# EAGLE design reDotSmart_0402_rev2 (EAGLE 7.2.0)
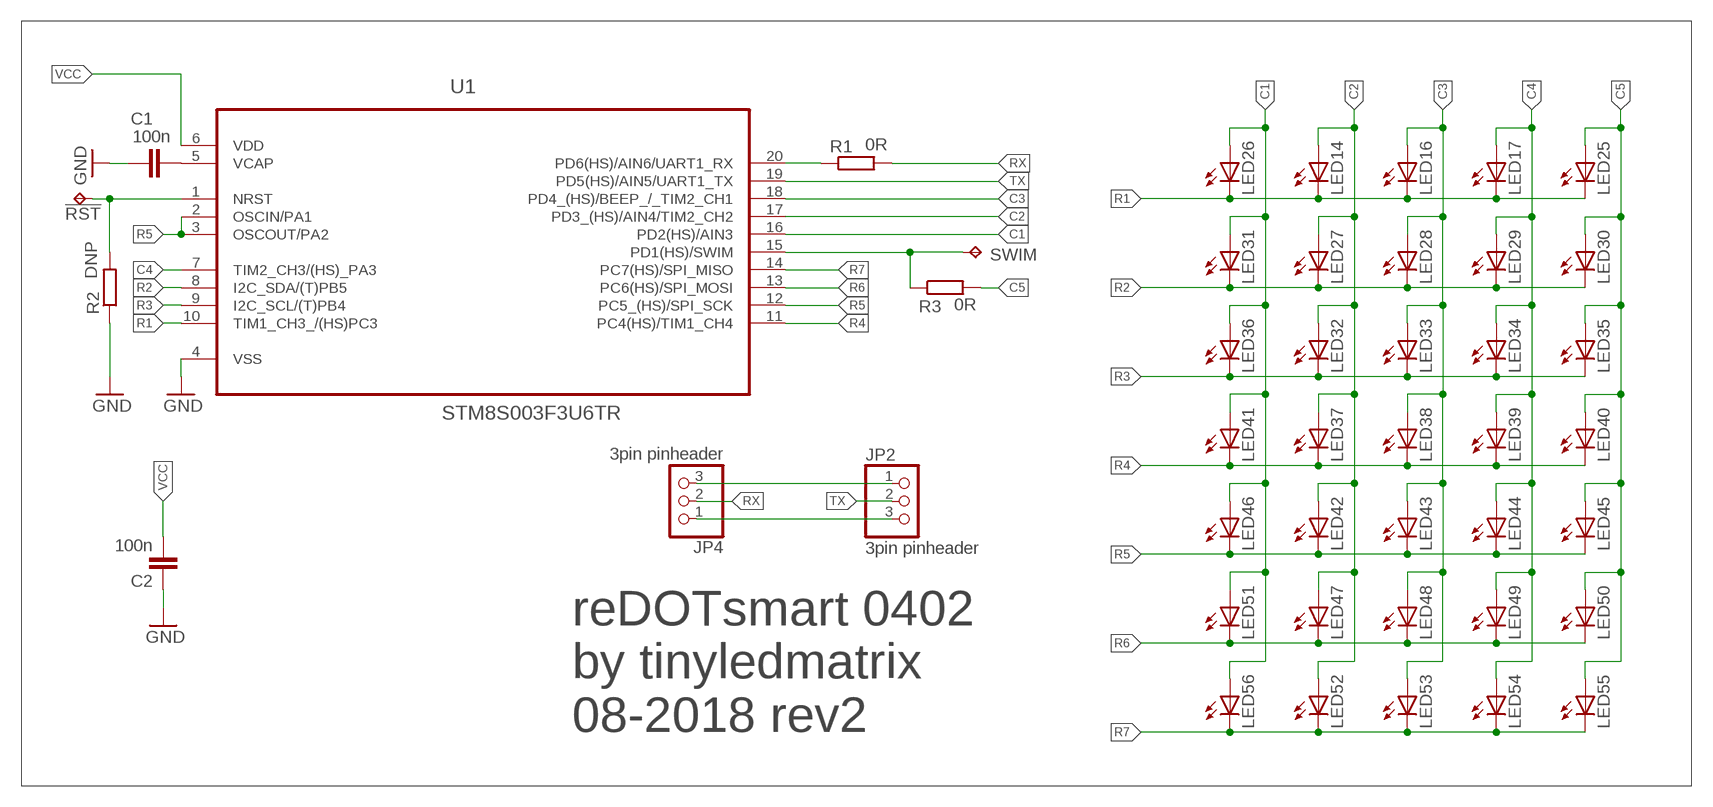
[diagram p0: schematic, sheet 1]

## Parts
!RST  TPTP10R  [TP10R]
C1  100n  C-EU0402_VISHAY  [C0402-VISHAY]
C2  100n  C-EU0402_VISHAY  [C0402-VISHAY]
JP2  3pin pinheader  PINHD-1X3NOSM  [1X03_ROUND_NOSM]
JP4  3pin pinheader  PINHD-1X3NOSM  [1X03_ROUND_NOSM]
LED14  LED0402_ROHM  [LED0402_E_ROHM_SML-P1]
LED16  LED0402_ROHM  [LED0402_E_ROHM_SML-P1]
LED17  LED0402_ROHM  [LED0402_E_ROHM_SML-P1]
LED25  LED0402_ROHM  [LED0402_E_ROHM_SML-P1]
LED26  LED0402_ROHM  [LED0402_E_ROHM_SML-P1]
LED27  LED0402_ROHM  [LED0402_E_ROHM_SML-P1]
LED28  LED0402_ROHM  [LED0402_E_ROHM_SML-P1]
LED29  LED0402_ROHM  [LED0402_E_ROHM_SML-P1]
LED30  LED0402_ROHM  [LED0402_E_ROHM_SML-P1]
LED31  LED0402_ROHM  [LED0402_E_ROHM_SML-P1]
LED32  LED0402_ROHM  [LED0402_E_ROHM_SML-P1]
LED33  LED0402_ROHM  [LED0402_E_ROHM_SML-P1]
LED34  LED0402_ROHM  [LED0402_E_ROHM_SML-P1]
LED35  LED0402_ROHM  [LED0402_E_ROHM_SML-P1]
LED36  LED0402_ROHM  [LED0402_E_ROHM_SML-P1]
LED37  LED0402_ROHM  [LED0402_E_ROHM_SML-P1]
LED38  LED0402_ROHM  [LED0402_E_ROHM_SML-P1]
LED39  LED0402_ROHM  [LED0402_E_ROHM_SML-P1]
LED40  LED0402_ROHM  [LED0402_E_ROHM_SML-P1]
LED41  LED0402_ROHM  [LED0402_E_ROHM_SML-P1]
LED42  LED0402_ROHM  [LED0402_E_ROHM_SML-P1]
LED43  LED0402_ROHM  [LED0402_E_ROHM_SML-P1]
LED44  LED0402_ROHM  [LED0402_E_ROHM_SML-P1]
LED45  LED0402_ROHM  [LED0402_E_ROHM_SML-P1]
LED46  LED0402_ROHM  [LED0402_E_ROHM_SML-P1]
LED47  LED0402_ROHM  [LED0402_E_ROHM_SML-P1]
LED48  LED0402_ROHM  [LED0402_E_ROHM_SML-P1]
LED49  LED0402_ROHM  [LED0402_E_ROHM_SML-P1]
LED50  LED0402_ROHM  [LED0402_E_ROHM_SML-P1]
LED51  LED0402_ROHM  [LED0402_E_ROHM_SML-P1]
LED52  LED0402_ROHM  [LED0402_E_ROHM_SML-P1]
LED53  LED0402_ROHM  [LED0402_E_ROHM_SML-P1]
LED54  LED0402_ROHM  [LED0402_E_ROHM_SML-P1]
LED55  LED0402_ROHM  [LED0402_E_ROHM_SML-P1]
LED56  LED0402_ROHM  [LED0402_E_ROHM_SML-P1]
R1  0R  R-EU_R0402-VISHAY  [ADAFRUIT_R0402-VISHAY]
R2  DNP  R-EU_R0402-VISHAY  [ADAFRUIT_R0402-VISHAY]
R3  0R  R-EU_R0603-VISHAY  [ADAFRUIT_R0603-VISHAY]
SWIM  TPTP10R  [TP10R]
U1  STM8S003F3U6TR  [QFN50P300X300X100-20N_STM]

## Nets
C1: LED26.A LED31.A LED36.A LED41.A LED46.A LED51.A LED56.A U1.16(PD2(HS)/AIN3)
C2: LED14.A LED27.A LED32.A LED37.A LED42.A LED47.A LED52.A U1.17(PD3_(HS)/AIN4/TIM2_CH2)
C3: LED16.A LED28.A LED33.A LED38.A LED43.A LED48.A LED53.A U1.18(PD4_(HS)/BEEP_/_TIM2_CH1)
C4: LED17.A LED29.A LED34.A LED39.A LED44.A LED49.A LED54.A U1.7(TIM2_CH3/(HS)_PA3)
C5: LED25.A LED30.A LED35.A LED40.A LED45.A LED50.A LED55.A R3.2
GND: C1.1 C2.1 JP2.1 JP4.3 R2.1 U1.4(VSS)
N$3: R1.1 U1.20(PD6(HS)/AIN6/UART1_RX)
N$4: R3.1 SWIM.TP U1.15(PD1(HS)/SWIM)
N$10: C1.2 U1.5(VCAP)
NRST: !RST.TP R2.2 U1.1(NRST)
R1: LED14.K(C) LED16.K(C) LED17.K(C) LED25.K(C) LED26.K(C) U1.10(TIM1_CH3_/(HS)PC3)
R2: LED27.K(C) LED28.K(C) LED29.K(C) LED30.K(C) LED31.K(C) U1.8(I2C_SDA/(T)PB5)
R3: LED32.K(C) LED33.K(C) LED34.K(C) LED35.K(C) LED36.K(C) U1.9(I2C_SCL/(T)PB4)
R4: LED37.K(C) LED38.K(C) LED39.K(C) LED40.K(C) LED41.K(C) U1.11(PC4(HS)/TIM1_CH4)
R5: LED42.K(C) LED43.K(C) LED44.K(C) LED45.K(C) LED46.K(C) U1.2(OSCIN/PA1) U1.3(OSCOUT/PA2) U1.12(PC5_(HS)/SPI_SCK)
R6: LED47.K(C) LED48.K(C) LED49.K(C) LED50.K(C) LED51.K(C) U1.13(PC6(HS)/SPI_MOSI)
R7: LED52.K(C) LED53.K(C) LED54.K(C) LED55.K(C) LED56.K(C) U1.14(PC7(HS)/SPI_MISO)
RX: JP4.2 R1.2
TX: JP2.2 U1.19(PD5(HS)/AIN5/UART1_TX)
VCC: C2.2 JP2.3 JP4.1 U1.6(VDD)

## Notes on the sheet
- reDOTsmart 0402
  by tinyledmatrix
  08-2018 rev2

## Library data of the parts
!RST SWIM = testpad:TP: Test pad
C1 C2 = rcl:C-EU: CAPACITOR, European symbol
JP2 JP4 = pinhead:PINHD-1X3: PIN HEADER
LED14 LED16 LED17 LED25-LED56 = led:LED: LED OSRAM: - CHIPLED LG R971, LG N971, LY N971, LG Q971, LY Q971, LO R971, LY R971 LH N974, LH R974 LS Q976, LO Q976, LY Q976 LO Q996 - Hyper CHIPLED LW Q18S LB Q993, LB Q99A, LB R99A - SideLED LS A670, LO A670, LY A670, LG A670, LP A670 LB A673, LV A673, LT A673, LW A673 LH A674 LY A675 LS A676, LA A676, LO A676, LY A676, LW A676 LS A679, LY A679, LG A679 - Hyper Micro SIDELED® LS Y876, LA Y876, LO Y876, LY Y876 LT Y87S - SmartLED LW L88C, LW L88S LB L89C, LB L89S, LG L890 LS L89K, LO L89K, LY L89K LS L896, LA L896, LO L896, LY L896 - TOPLED LS T670, LO T670, LY T670, LG T670, LP T670 LSG T670, LSP T670, LSY T670, LOP T670, LYG T670 LG T671, LOG T671, LSG T671 LB T673, LV T673, LT T673, LW T673 LH T674 LS T676, LA T676, LO T676, LY T676, LB T676, LH T676, LSB T676, LW T676 LB T67C, LV T67C, LT T67C, LS T67K, LO T67K, LY T67K, LW E67C LS E67B, LA E67B, LO E67B, LY E67B, LB E67C, LV E67C, LT E67C LW T67C LS T679, LY T679, LG T679 LS T770, LO T770, LY T770, LG T770, LP T770 LB T773, LV T773, LT T773, LW T773 LH T774 LS E675, LA E675, LY E675, LS T675 LS T776, LA T776, LO T776, LY T776, LB T776 LHGB T686 LT T68C, LB T68C - Hyper Mini TOPLED® LB M676 - Mini TOPLED Santana® LG M470 LS M47K, LO M47K, LY M47K Source: http://www.osram.convergy.de LUXEON: - LUMILED® LXK2-PW12-R00, LXK2-PW12-S00, LXK2-PW14-U00, LXK2-PW14-V00 LXK2-PM12-R00, LXK2-PM12-S00, LXK2-PM14-U00 LXK2-PE12-Q00, LXK2-PE12-R00, LXK2-PE12-S00, LXK2-PE14-T00, LXK2-PE14-U00 LXK2-PB12-K00, LXK2-PB12-L00, LXK2-PB12-M00, LXK2-PB14-N00, LXK2-PB14-P00, LXK2-PB14-Q00 LXK2-PR12-L00, LXK2-PR12-M00, LXK2-PR14-Q00, LXK2-PR14-R00 LXK2-PD12-Q00, LXK2-PD12-R00, LXK2-PD12-S00 LXK2-PH12-R00, LXK2-PH12-S00 LXK2-PL12-P00, LXK2-PL12-Q00, LXK2-PL12-R00 Source: www.luxeon.com KINGBRIGHT: KA-3528ASYC Source: www.kingbright.com
R1-R3 = rcl:R-EU_: RESISTOR, European symbol
U1 = STM-STM8S003_L78LxxUTR:STM8S003F3U6TR: Value line, 16 MHz STM8S 8-bit MCU, 8 Kbytes Flash, 128 bytes data EEPROM, 10-bit ADC, 3 timers, UART, SPI, I²C,20UFQFPN; MPN: STM8S003F3U6TR; OC_FARNELL: 2070941; OC_NEWARK: 75T8339; PACKAGE: 20UFQFPN; SUPPLIER: STMicroelectronics

## Board
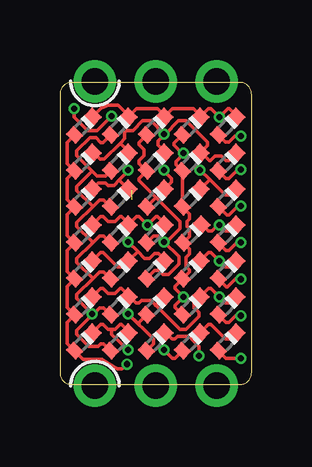
[diagram p1: board, top side]
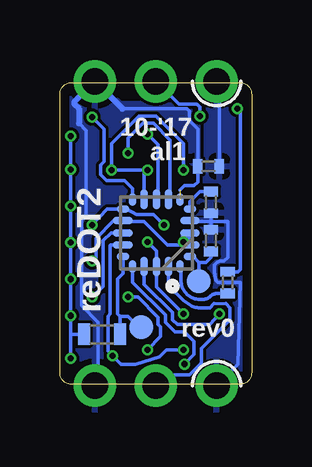
[diagram p2: board, bottom side, seen from below]

Size 8 x 12.6 mm. Coordinates in mm from the lower left corner, seen from the top.
Outline: 0,12.1 0,0.5 arc90 0.5,0 7.5,0 arc90 8,0.5 8,12.1 arc90 7.5,12.6 0.5,12.6 arc90 0,12.1
Copper layers (1*16): Top 0.035559375mm / dielectric 0.17018125mm / Bottom 0.035559375mm
Design rules "OSHPark-4layer *": minimum track width 5mil, minimum drill 10mil, track to track 5mil, track to pad 5mil, pad to pad 5mil, via to via 5mil, smd to smd 5mil, copper to edge 15mil, drill to drill 6mil, minimum pad ring 4mil, minimum via ring 4mil, stop-mask expansion 1mil, vias tented up to drill 10mil, thermal gap 10mil
bRestrict: 2 lines

### Footprints (pad centres in the part's own frame; a part is rotated, then mirrored left to right if it is on the bottom)
TP10R = smd 1 x 1: TP 0,0
C0402-VISHAY = smd 0.4 x 0.6: 1 -0.45,0; 2 0.45,0
1X03_ROUND_NOSM = drill 1.1 pad 1.778: 1 -2.54,0; 2 0,0; 3 2.54,0
LED0402_E_ROHM_SML-P1 = smd 0.5 x 0.6: A 0.55,0; K -0.55,0
ADAFRUIT_R0402-VISHAY = smd 0.4 x 0.6: 1 -0.45,0; 2 0.45,0
ADAFRUIT_R0603-VISHAY = smd 0.5 x 0.9: 1 -0.75,0; 2 0.75,0
QFN50P300X300X100-20N_STM = smd 0.508 x 0.305: 1 -1.397,0.991; 5 -1.397,-0.991; 11 1.397,-0.991; 15 1.397,0.991 | smd 0.813 x 0.305: 2 -1.397,0.508; 3 -1.397,0; 4 -1.397,-0.508; 12 1.397,-0.508; 13 1.397,0; 14 1.397,0.508 | smd 0.305 x 0.508: 6 -0.991,-1.397; 10 0.991,-1.397; 16 0.991,1.397; 20 -0.991,1.397 | smd 0.305 x 0.813: 7 -0.508,-1.397; 8 0,-1.397; 9 0.508,-1.397; 17 0.508,1.397; 18 0,1.397; 19 -0.508,1.397

### Placement (x,y rotation side)
!RST  2.2,4.3 0 bottom
C1  1.7,7.6 90 bottom
C2  1.8,9.1 180 bottom
JP2  4,-0.05 0 top
JP4  4,12.65 180 top
LED14  2.5,10.8 225 top
LED16  4,10.8 225 top
LED17  5.5,10.8 225 top
LED25  7,10.8 225 top
LED26  1,10.8 225 top
LED27  2.5,9.3 225 top
LED28  4,9.3 225 top
LED29  5.5,9.3 225 top
LED30  7,9.3 225 top
LED31  1,9.3 225 top
LED32  2.5,7.8 225 top
LED33  4,7.8 225 top
LED34  5.5,7.8 225 top
LED35  7,7.8 225 top
LED36  1,7.8 225 top
LED37  2.5,6.3 225 top
LED38  4,6.3 225 top
LED39  5.52,6.3 225 top
LED40  7,6.3 225 top
LED41  1,6.3 225 top
LED42  2.5,4.8 225 top
LED43  4,4.8 225 top
LED44  5.5,4.8 225 top
LED45  7,4.8 225 top
LED46  1,4.8 225 top
LED47  2.5,3.3 225 top
LED48  4,3.3 225 top
LED49  5.5,3.3 225 top
LED50  7,3.3 225 top
LED51  1,3.3 225 top
LED52  2.5,1.8 225 top
LED53  4,1.8 225 top
LED54  5.5,1.8 225 top
LED55  7,1.8 225 top
LED56  1,1.8 225 top
R1  1,4.25 90 bottom
R2  1.7,6 270 bottom
R3  6.25,2.1 180 bottom
SWIM  4.6,2.4 0 bottom
U1  3.97,6.33 180 bottom

### Tracks (layer width: path | path; a pad name or v marks a point on that pad's centre or on a via)
C1  (via drill 0.25)
  Top 0.127: 1.75,1.05 2.4,0.65
  Top 0.15: LED26.A 0.3,10.1 0.3,9.22 LED31.A 0.3,8.6 0.3,7.72 LED36.A 0.3,7.1 0.3,6.22 LED41.A 0.3,5.6 0.3,4.72 LED46.A 0.3,4.1 0.3,3.22 LED51.A 0.3,2.6 0.3,1.72 LED56.A 0.97,1.05 1.75,1.05 | 2.4,0.65 2.6,0.65 v2.8,0.85
  Bottom 0.15: v2.8,0.85 2.4,1.25 2.4,1.8 2.8,2.2 3.2,2.2 3.6,2.6 3.6,2.9 4.96,4.26 U1.16
C2  (via drill 0.25)
  Top 0.15: 1.38,4.42 0.7,5.1 0.7,5.25 1.34,5.89 | LED14.A 1.8,10.1 1.7,10.1 1.5,10.3 1.25,10.3 0.7,9.75 0.7,9.55 1.35,8.9 | LED52.A 1.82,1.7 1.7,1.7 1.6,1.6 1.2,1.6 0.7,2.1 0.7,2.25 1.35,2.9 v1.35,2.95 | LED42.A 1.82,4.7 1.65,4.7 1.38,4.42 | v1.35,2.95 0.7,3.6 0.7,3.75 1.38,4.42 | LED47.A 1.82,3.2 1.65,3.2 1.4,2.95 v1.35,2.95 | LED27.A 1.9,8.7 1.55,8.7 1.35,8.9 | 1.35,8.9 0.7,8.25 0.7,8.1 1.38,7.42 | LED32.A 1.82,7.7 1.65,7.7 1.38,7.42 | 1.38,7.42 0.7,6.75 0.7,6.6 1.34,5.96 1.34,5.89 | 1.34,5.89 1.65,6.2 1.82,6.2 LED37.A
  Bottom 0.15: U1.17 4.48,4.18 3.3,3 3.3,2.7 3.1,2.5 1.75,2.5 v1.35,2.95
C3  (via drill 0.25)
  Top 0.15: LED43.A 3.95,4.75 4.15,4.75 4.3,4.6 4.54,4.6 4.97,5.03 4.97,5.33 v4.35,5.95 | LED38.A 3.9,6.2 4.1,6.2 v4.35,5.95 | LED16.A | 4,7.8 3.3,8.5 3.3,8.6 LED28.A 3.3,9.22 3.3,9.35 3.5,9.55 3.5,9.8 3.3,10 3.3,10.1 LED16.A | 4,7.8 5,6.8 5,6.5 4.45,5.95 v4.35,5.95 | LED48.A 3.3,2.6 3.3,2.5 v2.85,2.95 3.9,1.9 3.9,1.7 LED53.A | LED33.A | LED33.A 4,7.8
  Bottom 0.15: v4.35,5.95 3.98,5.58 U1.18 3.98,4.07 v2.85,2.95
C4  (via drill 0.25)
  Top 0.15: LED17.A 4.76,10.06 4.76,9.98 5.09,9.65 v5.15,9.65 5.15,9.61 4.84,9.3 4.84,9.18 LED29.A LED34.A 5.4,7.12 5.4,6.9 5.3,6.8 5.3,6.6 5.4,6.5 5.4,6.18 LED39.A 5.4,5.65 5.4,5.45 5.25,5.3 5.25,4.92 5.4,4.78 5.4,4.7 LED44.A 4.8,4.1 4.8,4 v5.15,3.65 4.8,3.3 4.8,3.22 LED49.A | LED54.A 4.8,1.1 4.7,1.1 v4.35,1.45
  Bottom 0.15: U1.7 3.47,7.83 3.4,7.9 3.4,10.2 4.1,10.9 4.52,10.9 5.15,10.27 v5.15,9.65 | v5.15,3.65 4.75,3.65 3.9,2.8 3.9,2.5 3.8,2.4 3.8,2 v4.35,1.45
C5  (via drill 0.25)
  Top 0.15: LED25.A 6.91,10.11 7.05,10.11 7.3,10.36 v7.56,10.36 | LED30.A 6.94,8.59 7.05,8.59 7.43,8.97 v7.56,8.97 | LED35.A 6.96,7.06 7.05,7.06 7.43,7.44 v7.56,7.44 | LED40.A 6.93,5.59 7.05,5.59 7.38,5.92 v7.56,5.92 | LED45.A 6.96,4.06 7,4.06 7.33,4.39 v7.56,4.39 | v7.56,2.87 7.33,2.87 7.05,2.59 6.93,2.59 LED50.A | LED55.A 6.93,1.09 v7.56,1.09
  Bottom 0.15: v7.56,10.36 v7.56,8.97 v7.56,7.44 v7.56,5.92 v7.56,4.39 v7.56,2.87 7.56,2.1 | v7.56,1.09 7.56,2.1 | R3.2 7.56,2.1
GND
  Bottom 0.15: 1,0.41 JP2.1 | 0.58,0.83 0.48,4.25 1.4,4.25 1.48,4.33 1.48,4.35 1.55,4.67 1.55,4.99 1.44,5.1 1.32,5.15 1.15,5.15 1,5.3 1,6.8 1.7,6.8 | U1.4 2.54,6.8 1.7,6.8 | 1.7,6.8 R2.1 | 1.55,12.56 1.35,12.36 C2.1 | C1.1 1.7,6.8
  Bottom 0.152: 0.58,0.83 JP2.1
  pour Bottom (rank 2): 2.5,12.7 2.3,-1.1 -0.4,-1.1 -0.4,12.8
N$3
  Bottom 0.15: R1.1 1.44,3.8 arc-45 1.71,3.69 arc45 2.05,3.55 2.15,3.55 arc90 2.95,4.35 2.95,4.89 arc-90 U1.20
N$4
  Bottom 0.15: SWIM.TP 4.7,2.4 5.15,2.85 5.5,2.85 | 5.5,2.85 5.6,2.95 5.6,4.4 5.37,4.63 U1.15 | 5.5,2.85 R3.1
N$10
  Bottom 0.15: U1.5 2.58,7.62 2.15,8.05 C1.2
NRST
  Bottom 0.15: U1.1 2.44,5.33 2.2,5.1 | 2.2,5.1 !RST.TP | R2.2 1.7,5.3 1.9,5.1 2.2,5.1
R1  (via drill 0.25)
  Top 0.15: LED25.K 7.07,11.51 7,11.51 v6.65,11.16 6.3,11.51 6.21,11.51 LED17.K 5.57,11.51 5.56,11.5 4.71,11.5 4.71,11.51 LED16.K 4.07,11.51 3.21,11.51 LED14.K 2.43,11.65 2.03,11.65 1.72,11.52 LED26.K
  Bottom 0.15: U1.10 4.96,8.16 5.3,8.5 6.05,8.5 6.3,8.75 6.3,9.15 6.15,9.3 6.15,10.66 v6.65,11.16 6.4,10.91
R2  (via drill 0.25)
  Top 0.15: LED28.K 4.1,9.98 4.1,10.15 4.38,10.43 | LED30.K 7.05,9.35 6.92,9.35 6.74,9.53 6.46,9.53 6.29,9.35 6.23,9.35 LED29.K 6.16,9.96 6.16,10.11 5.27,11 4.95,11 4.38,10.43 | 2.52,10.07 2.7,10.25 2.7,10.5 2.8,10.6 3.05,10.6 3.45,11 3.8,11 v4.35,10.45 4.38,10.43 | LED27.K 2.52,10.05 2.52,10.07 | 2.52,10.07 1.85,9.4 1.68,9.4 LED31.K
  Bottom 0.15: U1.8 3.98,7.92 3.9,8 3.9,10 v4.35,10.45
R3  (via drill 0.25)
  Top 0.15: LED36.K 1.6,8.4 1.9,8.4 2,8.3 2.25,8.3 2.48,8.53 | LED32.K 2.81,8.19 2.48,8.53 | 2.48,8.53 2.85,8.9 v2.85,8.95 | LED35.K 7.1,7.9 6.9,7.9 6.25,8.55 | 6.25,8.55 v5.85,8.95 | LED34.K 6.25,8.55 | LED33.K 4.65,8.45 4.65,8.6 4.39,8.86 4.39,8.89 4.35,8.93 v4.35,8.95
  Bottom 0.15: v2.85,8.95 2.85,10.05 4,11.2 4.7,11.2 5.85,10.05 v5.85,8.95 v4.35,8.95 4.48,8.95 U1.9
R4  (via drill 0.25)
  Top 0.15: LED38.K 4.08,7 4,7 v3.65,6.65 3.3,7 3.2,7 LED37.K 2.58,7 2.5,7 2.3,6.8 2,6.8 1.8,7 1.7,7 LED41.K | LED40.K 7.1,6.4 6.9,6.4 v6.65,6.65 6.6,6.65 6.35,6.4 6.2,6.4 LED39.K
  Bottom 0.15: v6.65,6.65 6.03,7.32 U1.11 5.22,7.32 4.8,7.1 4.1,7.1 v3.65,6.65
R5  (via drill 0.25)
  Top 0.15: LED43.K 4.12,5.46 3.94,5.46 3.74,5.26 3.54,5.26 3.25,5.55 | LED44.K 6.2,5.5 6.3,5.5 v6.65,5.15 6.9,4.9 7.1,4.9 LED45.K | LED46.K 1.7,5.5 1.8,5.5 2.4,4.9 2.6,4.9 LED42.K 3.25,5.55 | 3.25,5.55 v2.85,5.95
  Bottom 0.15: 2.88,5.82 3.52,5.82 4.5,6.8 5.34,6.8 U1.12 5.77,6.83 6.5,6.1 6.5,5.3 v6.65,5.15 | 2.88,5.82 2.78,5.82 | 2.78,5.82 2.68,5.82 | 2.68,5.82 U1.2 U1.3 2.68,6.33 | v2.85,5.95 2.85,6.33 2.78,6.33 | 2.78,6.33 2.68,6.33 | 2.68,6.33 2.68,5.82 | 2.78,6.33 2.78,5.82 | 2.88,6.33 2.88,5.82
R6  (via drill 0.25)
  Top 0.15: LED51.K 1.7,4 1.8,4 2,3.8 2.3,3.8 2.5,4 2.58,4 LED47.K 3.18,3.4 3.3,3.4 3.4,3.5 3.8,3.5 4,3.3 | 4,3.3 LED48.K | LED50.K 7.1,3.4 | 7.1,3.4 | 7.1,3.4 6.9,3.4 v6.65,3.65 6.3,4 6.2,4 LED49.K 5.6,3.4 5.6,3.2 5.8,3 5.8,2.85 5.25,2.3 5,2.3 4,3.3 | 4,3.3
  Bottom 0.15: v6.65,3.65 6.2,4.1 6.2,6 5.88,6.33 U1.13
R7  (via drill 0.25)
  Top 0.15: LED53.K 4.68,1.9 4.8,1.9 4.9,2 5.4,2 5.55,1.85 | LED56.K 1.7,2.5 1.8,2.5 2,2.3 2.15,2.3 | 2.15,2.3 2.3,2.3 2.5,2.5 2.58,2.5 LED52.K | v2.85,1.45 2.15,2.1 2.15,2.3 | LED55.K 7.1,1.9 6.9,1.9 6.3,2.5 6.2,2.5 LED54.K 5.55,1.85 | 5.55,1.85 5.8,1.6 v5.8,1.2 | 5.55,1.85
  Bottom 0.15: v2.85,1.45 3.55,1.45 3.85,1.15 4.85,0.85 5.45,0.85 v5.8,1.2 6,1.4 6,2.85 5.9,2.95 5.9,5.8 5.88,5.82 U1.14
RX  (via drill 0.25)
  Top 0.15: v2.15,11.2 1.55,10.6 1.15,10.6 0.6,11.15 v0.6,11.5
  Bottom 0.15: 2.15,11.55 v2.15,11.2 2.15,11.56 2.28,11.69 3.04,11.69 JP4.2 | R1.2 0.58,4.7 0.48,4.8 0.48,11.38 v0.6,11.5
TX
  Bottom 0.127: 1.58,3.38 1.08,3.38
  Bottom 0.15: 1.08,3.38 0.9,3.2 0.9,2.7 2.1,1.5 2.1,0.9 2.6,0.4 3.55,0.4 JP2.2 | U1.19 3.47,4.12 2.85,3.5 2.51,3.28 arc-27 2.17,3.2 1.75,3.2 1.58,3.38
VCC  (1 unrouted)
  Bottom 0.15: 7.2,10.9 6.9,10.6 6.9,7.1 7.1,6.9 7.1,3.3 6.4,2.6 6.4,0.09 JP2.3 | 5.39,11.5 2.7,11.5 2.6,11.4 2.6,11 2.25,10.65 C2.2 2.25,8.45 2.4,8.3 2.8,8.3 2.98,8.12
  Bottom 0.254: 5.39,11.5 JP4.1 7.4,11.79 7.4,11.7 7.2,11.5 7.2,10.9
  pour Bottom: 8.3,13.1 8.3,-1.1 5.7,-1.1 5.7,0.2 3.1,9.2 2.2,9.2 2.2,10.8 2.3,13.1

### Text on the board
bNames: 10-'17 | al1 | reDOT2 | rev0
Measures: GND | RX | Vcc | GND | TX | Vcc